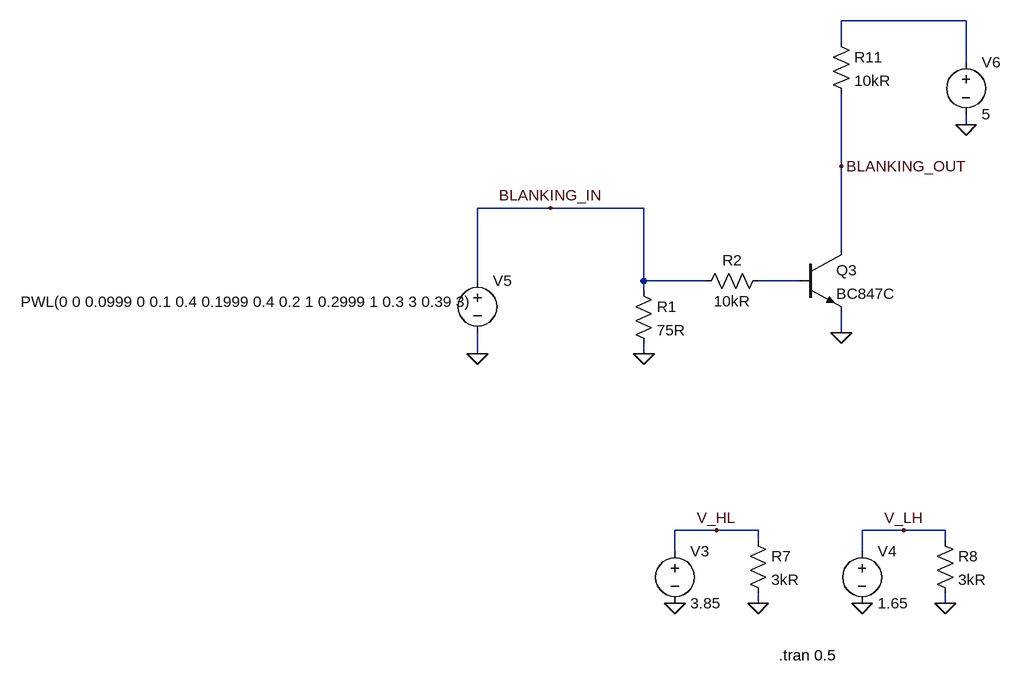
[diagram p0: schematic BLANKING_input_circuit.asc]
BLANKING_input_circuit.asc, the LTspice schematic file:
Version 4
SHEET 1 2012 680
WIRE 352 -832 160 -832
WIRE 160 -800 160 -832
WIRE 352 -768 352 -832
WIRE 352 -672 352 -688
WIRE 160 -608 160 -720
WIRE -288 -544 -400 -544
WIRE -144 -544 -288 -544
WIRE 160 -480 160 -608
WIRE -400 -432 -400 -544
WIRE -144 -432 -144 -544
WIRE -48 -432 -144 -432
WIRE 96 -432 32 -432
WIRE -144 -416 -144 -432
WIRE 160 -352 160 -384
WIRE -400 -320 -400 -352
WIRE -144 -320 -144 -336
WIRE -32 -48 -96 -48
WIRE 32 -48 -32 -48
WIRE 256 -48 192 -48
WIRE 320 -48 256 -48
WIRE 32 -32 32 -48
WIRE 320 -32 320 -48
WIRE -96 -16 -96 -48
WIRE 192 -16 192 -48
WIRE 32 64 32 48
WIRE 320 64 320 48
FLAG -96 64 0
FLAG 192 64 0
FLAG 32 64 0
FLAG 320 64 0
FLAG -32 -48 V_HL
FLAG 256 -48 V_LH
FLAG 160 -352 0
FLAG -400 -320 0
FLAG 352 -672 0
FLAG 160 -608 BLANKING_OUT
FLAG -288 -544 BLANKING_IN
FLAG -144 -320 0
SYMBOL voltage -96 -32 R0
WINDOW 123 0 0 Left 0
WINDOW 39 0 0 Left 0
SYMATTR InstName V3
SYMATTR Value 3.85
SYMBOL voltage 192 -32 R0
WINDOW 123 0 0 Left 0
WINDOW 39 0 0 Left 0
SYMATTR InstName V4
SYMATTR Value 1.65
SYMBOL res 16 -48 R0
SYMATTR InstName R7
SYMATTR Value 3kR
SYMBOL res 304 -48 R0
SYMATTR InstName R8
SYMATTR Value 3kR
SYMBOL npn 96 -480 R0
SYMATTR InstName Q3
SYMATTR Value BC847C
SYMBOL voltage -400 -448 R0
WINDOW 123 0 0 Left 0
WINDOW 39 0 0 Left 0
WINDOW 3 -703 48 Left 2
SYMATTR Value PWL(0 0 0.0999 0 0.1 0.4 0.1999 0.4 0.2 1 0.2999 1 0.3 3 0.39 3)
SYMATTR InstName V5
SYMBOL res 144 -816 R0
SYMATTR InstName R11
SYMATTR Value 10kR
SYMBOL voltage 352 -784 R0
WINDOW 123 0 0 Left 0
WINDOW 39 0 0 Left 0
SYMATTR InstName V6
SYMATTR Value 5
SYMBOL res -160 -432 R0
SYMATTR InstName R1
SYMATTR Value 75R
SYMBOL res 48 -448 R90
WINDOW 0 0 56 VBottom 2
WINDOW 3 32 56 VTop 2
SYMATTR InstName R2
SYMATTR Value 10kR
TEXT 64 144 Left 2 !.tran 0.5

The netlist it stands for:
* BLANKING_input_circuit.asc
V3 V_HL 0 3.85
V4 V_LH 0 1.65
R7 V_HL 0 3kR
R8 V_LH 0 3kR
Q3 BLANKING_OUT N002 0 0 BC847C
V5 BLANKING_IN 0 PWL(0 0 0.0999 0 0.1 0.4 0.1999 0.4 0.2 1 0.2999 1 0.3 3 0.39 3)
R11 N001 BLANKING_OUT 10kR
V6 N001 0 5
R1 BLANKING_IN 0 75R
R2 N002 BLANKING_IN 10kR
.model NPN NPN
.model PNP PNP
.lib standard.bjt
.tran 0.5
.backanno
.end